# EAGLE design PdlSerialAdapter (EAGLE 7.7.0)
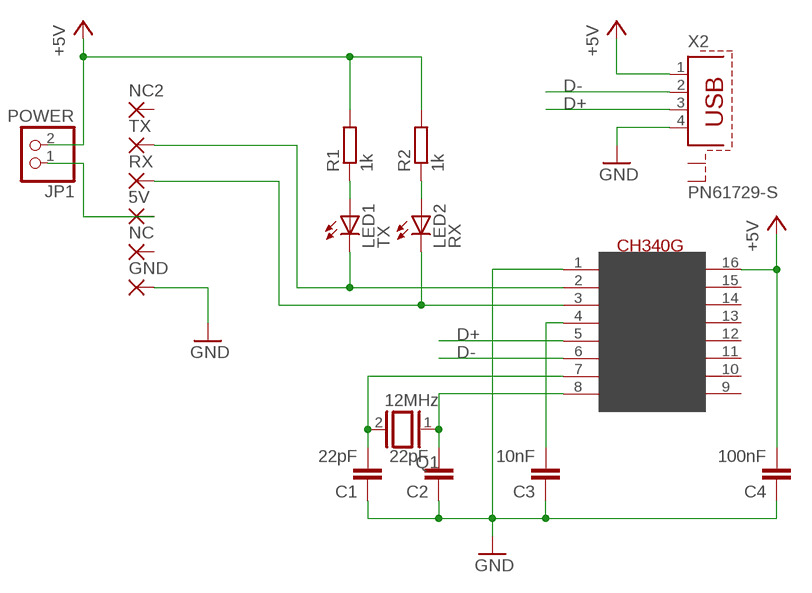
[diagram p0: schematic, sheet 1]

## Parts
5V  SMD2  [SMD1,27-2,54]
C1  22pF  C-EU025-025X050  [C025-025X050]
C2  22pF  C-EU025-025X050  [C025-025X050]
C3  10nF  C-EU050-030X075  [C050-030X075]
C4  100nF  C-EU050-030X075  [C050-030X075]
GND  SMD2  [SMD1,27-2,54]
JP1  POWER  PINHD-1X2  [1X02]
LED1  TX  LED3MM  [LED3MM]
LED2  RX  LED3MM  [LED3MM]
NC  SMD2  [SMD1,27-2,54]
NC2  SMD2  [SMD1,27-2,54]
Q1  12MHz  XTAL/S  [QS]
R1  1k  R-EU_0207/2V  [0207/2V]
R2  1k  R-EU_0207/2V  [0207/2V]
RX  SMD2  [SMD1,27-2,54]
TX  SMD2  [SMD1,27-2,54]
U$1  CH340G  [SOIC16]
X2  PN61729-S  [PN61729-S]

## Nets
+5V: C4.2 JP1.2 R1.2 R2.2 U$1.16(VCC) X2.1
D+: U$1.5(D+) X2.3
D-: U$1.6(D-) X2.2
GND: C1.1 C2.1 C3.1 C4.1 GND.1(P) U$1.1(GND) X2.4
N$1: C1.2 Q1.2 U$1.7(XI)
N$2: C2.2 Q1.1 U$1.8(XO)
N$3: 5V.1(P) JP1.1
N$4: C3.2 U$1.4(V3)
N$5: LED1.K(C) TX.1(P) U$1.2(TX)
N$6: LED1.A R1.1
N$7: LED2.A R2.1
RX: LED2.K(C) RX.1(P) U$1.3(RX)
Unconnected: NC2.1(P) NC.1(P) U$1.9(CTS) U$1.10(DSR) U$1.11(RI) U$1.12(DCD) U$1.13(DTR) U$1.14(RTS) U$1.15(RS232) X2.S1 X2.S2

## Library data of the parts
5V GND NC NC2 RX TX = wirepad:SMD2: SMD PAD
C1-C4 = rcl:C-EU: CAPACITOR, European symbol
JP1 = pinhead:PINHD-1X2: PIN HEADER
LED1 LED2 = led:LED: LED OSRAM: - CHIPLED LG R971, LG N971, LY N971, LG Q971, LY Q971, LO R971, LY R971 LH N974, LH R974 LS Q976, LO Q976, LY Q976 LO Q996 - Hyper CHIPLED LW Q18S LB Q993, LB Q99A, LB R99A - SideLED LS A670, LO A670, LY A670, LG A670, LP A670 LB A673, LV A673, LT A673, LW A673 LH A674 LY A675 LS A676, LA A676, LO A676, LY A676, LW A676 LS A679, LY A679, LG A679 - Hyper Micro SIDELED® LS Y876, LA Y876, LO Y876, LY Y876 LT Y87S - SmartLED LW L88C, LW L88S LB L89C, LB L89S, LG L890 LS L89K, LO L89K, LY L89K LS L896, LA L896, LO L896, LY L896 - TOPLED LS T670, LO T670, LY T670, LG T670, LP T670 LSG T670, LSP T670, LSY T670, LOP T670, LYG T670 LG T671, LOG T671, LSG T671 LB T673, LV T673, LT T673, LW T673 LH T674 LS T676, LA T676, LO T676, LY T676, LB T676, LH T676, LSB T676, LW T676 LB T67C, LV T67C, LT T67C, LS T67K, LO T67K, LY T67K, LW E67C LS E67B, LA E67B, LO E67B, LY E67B, LB E67C, LV E67C, LT E67C LW T67C LS T679, LY T679, LG T679 LS T770, LO T770, LY T770, LG T770, LP T770 LB T773, LV T773, LT T773, LW T773 LH T774 LS E675, LA E675, LY E675, LS T675 LS T776, LA T776, LO T776, LY T776, LB T776 LHGB T686 LT T68C, LB T68C - Hyper Mini TOPLED® LB M676 - Mini TOPLED Santana® LG M470 LS M47K, LO M47K, LY M47K Source: http://www.osram.convergy.de LUXEON: - LUMILED® LXK2-PW12-R00, LXK2-PW12-S00, LXK2-PW14-U00, LXK2-PW14-V00 LXK2-PM12-R00, LXK2-PM12-S00, LXK2-PM14-U00 LXK2-PE12-Q00, LXK2-PE12-R00, LXK2-PE12-S00, LXK2-PE14-T00, LXK2-PE14-U00 LXK2-PB12-K00, LXK2-PB12-L00, LXK2-PB12-M00, LXK2-PB14-N00, LXK2-PB14-P00, LXK2-PB14-Q00 LXK2-PR12-L00, LXK2-PR12-M00, LXK2-PR14-Q00, LXK2-PR14-R00 LXK2-PD12-Q00, LXK2-PD12-R00, LXK2-PD12-S00 LXK2-PH12-R00, LXK2-PH12-S00 LXK2-PL12-P00, LXK2-PL12-Q00, LXK2-PL12-R00 Source: www.luxeon.com KINGBRIGHT: KA-3528ASYC Source: www.kingbright.com
Q1 = special:XTAL/S: CRYSTAL
R1 R2 = rcl:R-EU_: RESISTOR, European symbol
U$1 = usb-serial:CH340G
X2 = con-berg:PN61729-S: BERG USB connector; OC_FARNELL: unknown; OC_NEWARK: unknown

## Board
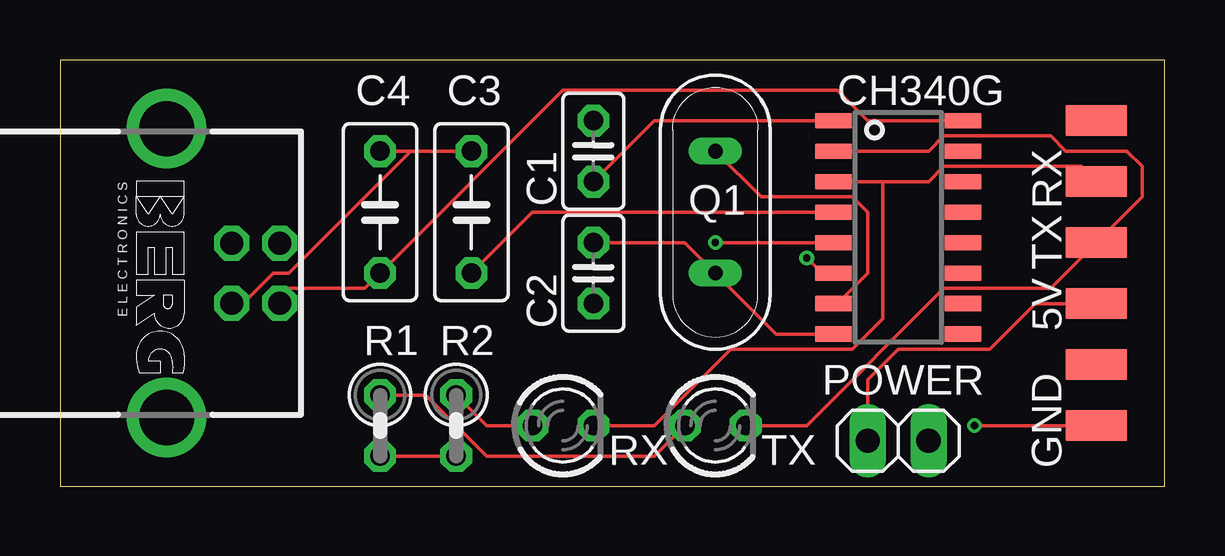
[diagram p1: board, top side]
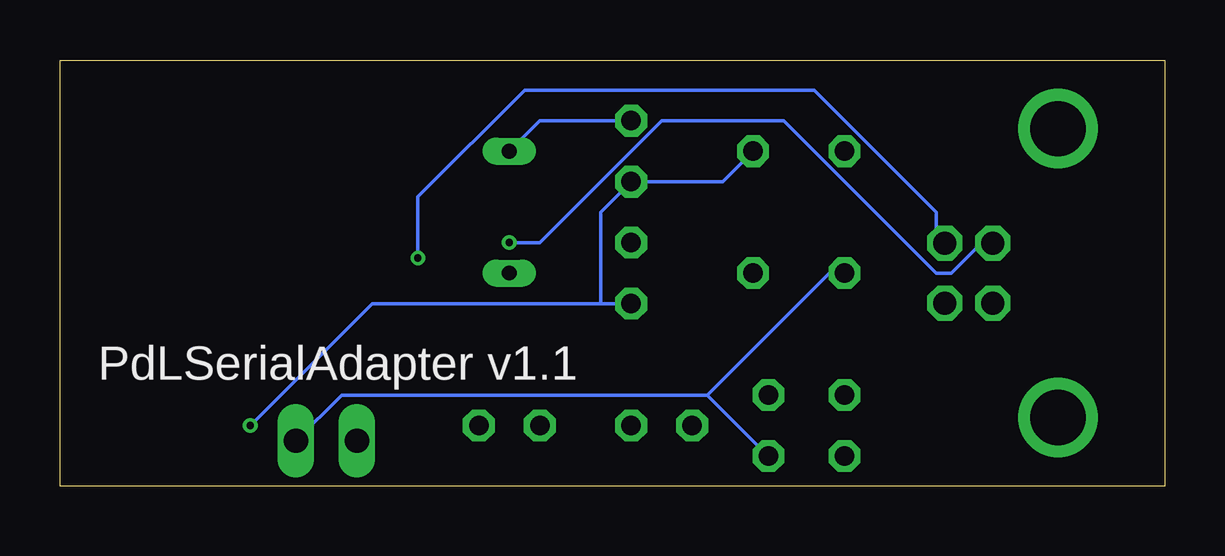
[diagram p2: board, bottom side, seen from below]

Size 46.02 x 17.77 mm. Coordinates in mm from the lower left corner, seen from the top.
Outline: 0,0 46.02,0 46.02,17.77 0,17.77 0,0
Copper layers (1*16): Top 0.035mm / dielectric 1.5mm / Bottom 0.035mm
Design rules "SeeedStudio_2layer_DRU_no_angle_20140221": minimum track width 6mil, minimum drill 12mil, track to track 6mil, track to pad 6mil, pad to pad 6mil, via to via 6mil, smd to smd 0mil, copper to edge 10mil, drill to drill 10mil, minimum pad ring 10mil, minimum via ring 6mil, stop-mask expansion 2mil, vias tented up to drill 100mil, thermal gap 10mil

### Footprints (pad centres in the part's own frame; a part is rotated, then mirrored left to right if it is on the bottom)
SMD1,27-2,54 = smd 1.27 x 2.54: 1 0,0
C025-025X050 = drill 0.813 octagon: 1 -1.27,0; 2 1.27,0
C050-030X075 = drill 0.813 octagon: 1 -2.54,0; 2 2.54,0
1X02 = drill 1.016 long: 1 -1.27,0; 2 1.27,0
LED3MM = drill 0.813 octagon: A -1.27,0; K 1.27,0
QS = drill 0.61 long: 1 -2.54,0; 2 2.54,0
0207/2V = drill 0.813 octagon: 1 -1.27,0; 2 1.27,0
SOIC16 = smd 0.635 x 1.524: 1 -4.445,-2.695; 2 -3.175,-2.695; 3 -1.905,-2.695; 4 -0.635,-2.695; 5 0.635,-2.695; 6 1.905,-2.695; 7 3.175,-2.695; 8 4.445,-2.695; 9 4.445,2.695; 10 3.175,2.695; 11 1.905,2.695; 12 0.635,2.695; 13 -0.635,2.695; 14 -1.905,2.695; 15 -3.175,2.695; 16 -4.445,2.695
PN61729-S = drill 0.95 octagon: 1 1.25,4.71; 2 -1.25,4.71; 3 -1.25,2.71; 4 1.25,2.71 | drill 2.3 pad 2.9: S1 -6.02,0; S2 6.02,0

### Placement (x,y rotation side)
5V  43.18,7.62 90 top
C1  22.23,13.97 90 top
C2  22.23,8.89 90 top
C3  17.15,11.43 270 top
C4  13.33,11.43 270 top
GND  43.18,2.54 90 top
JP1  34.92,1.9 0 top
LED1  27.3,2.54 0 top
LED2  20.95,2.54 0 top
NC  43.18,5.08 90 top
NC2  43.18,15.24 90 top
Q1  27.3,11.43 90 top
R1  13.33,2.54 270 top
R2  16.51,2.54 270 top
RX  43.18,12.7 90 top
TX  43.18,10.16 90 top
U$1  34.92,10.79 270 top
X2  4.45,8.89 270 top

### Tracks (layer width: path | path; a pad name or v marks a point on that pad's centre or on a via)
+5V
  Top 0.152: R2.2 R1.2 | U$1.16 33.66,15.24 32.38,16.51 20.95,16.51 C4.2 12.7,8.26 9.53,8.26 X2.1
  Bottom 0.152: JP1.2 34.29,3.81 19.05,3.81 | R2.2 19.05,3.81 | 19.05,3.81 13.97,8.89 C4.2
D+  (via drill 0.3)
  Top 0.152: v27.3,10.16 U$1.5
  Bottom 0.152: v27.3,10.16 26.03,10.16 20.95,15.24 15.88,15.24 9.53,8.89 8.89,8.89 7.62,10.16 X2.3
D-  (via drill 0.3)
  Top 0.152: v31.12,9.53 31.75,8.89 U$1.6
  Bottom 0.152: v31.12,9.53 31.12,12.07 26.67,16.51 14.6,16.51 9.53,11.43 9.53,10.16 X2.2
GND  (via drill 0.3)
  Top 0.152: v38.1,2.54 GND.1 | U$1.1 24.77,15.24 C1.1 | C3.1 14.6,13.97 | 14.6,13.97 C4.1 | 14.6,13.97 9.53,8.89 8.89,8.89 7.62,7.62 X2.4
  Bottom 0.152: v38.1,2.54 33.02,7.62 23.49,7.62 | C2.1 23.49,7.62 | C3.1 18.41,12.7 C1.1 23.49,11.43 23.49,7.62
N$1
  Top 0.152: Q1.2 29.21,12.07 33.02,12.07 33.66,11.43 33.66,8.89 32.38,7.62 U$1.7
  Bottom 0.152: C1.2 26.03,15.24 Q1.2
N$2
  Top 0.152: U$1.8 29.84,6.35 Q1.1 26.03,10.16 C2.2
N$3
  Top 0.152: 5V.1 40.64,7.62 38.73,5.71 34.92,5.71 33.66,4.45 JP1.1
N$4
  Top 0.152: U$1.4 19.69,11.43 C3.2
N$5
  Top 0.152: U$1.2 36.2,13.97 36.83,14.61 41.27,14.61 41.91,13.97 44.45,13.97 45.09,13.34 45.09,12.07 TX.1 41.27,8.26 36.83,8.26 31.12,2.54 LED1.K
N$6
  Top 0.152: R1.1 15.24,3.81 17.78,1.27 24.77,1.27 LED1.A
N$7
  Top 0.152: LED2.A 17.78,2.54 R2.1
RX
  Top 0.152: 34.29,12.7 36.2,12.7 36.83,13.34 42.55,13.34 RX.1 | 34.29,12.7 U$1.3 | LED2.K 24.77,2.54 27.94,5.71 33.02,5.71 34.29,6.99 34.29,12.7

### Text on the board
bNames: PdLSerialAdapter v1.1